# EasyEDA Pro project RGB_Connect_CG_EASYEDA_PROJECT.epro

# Schematic Schematic1
Board Name: Board1; Create Date: 2025-12-11; Page Name: P1; Project Name: RGB Connect; Schematic Name: Schematic1; Update Date: 2025-12-15; Company: EasyEDA.com; Page Size: A4; Version: V1.0
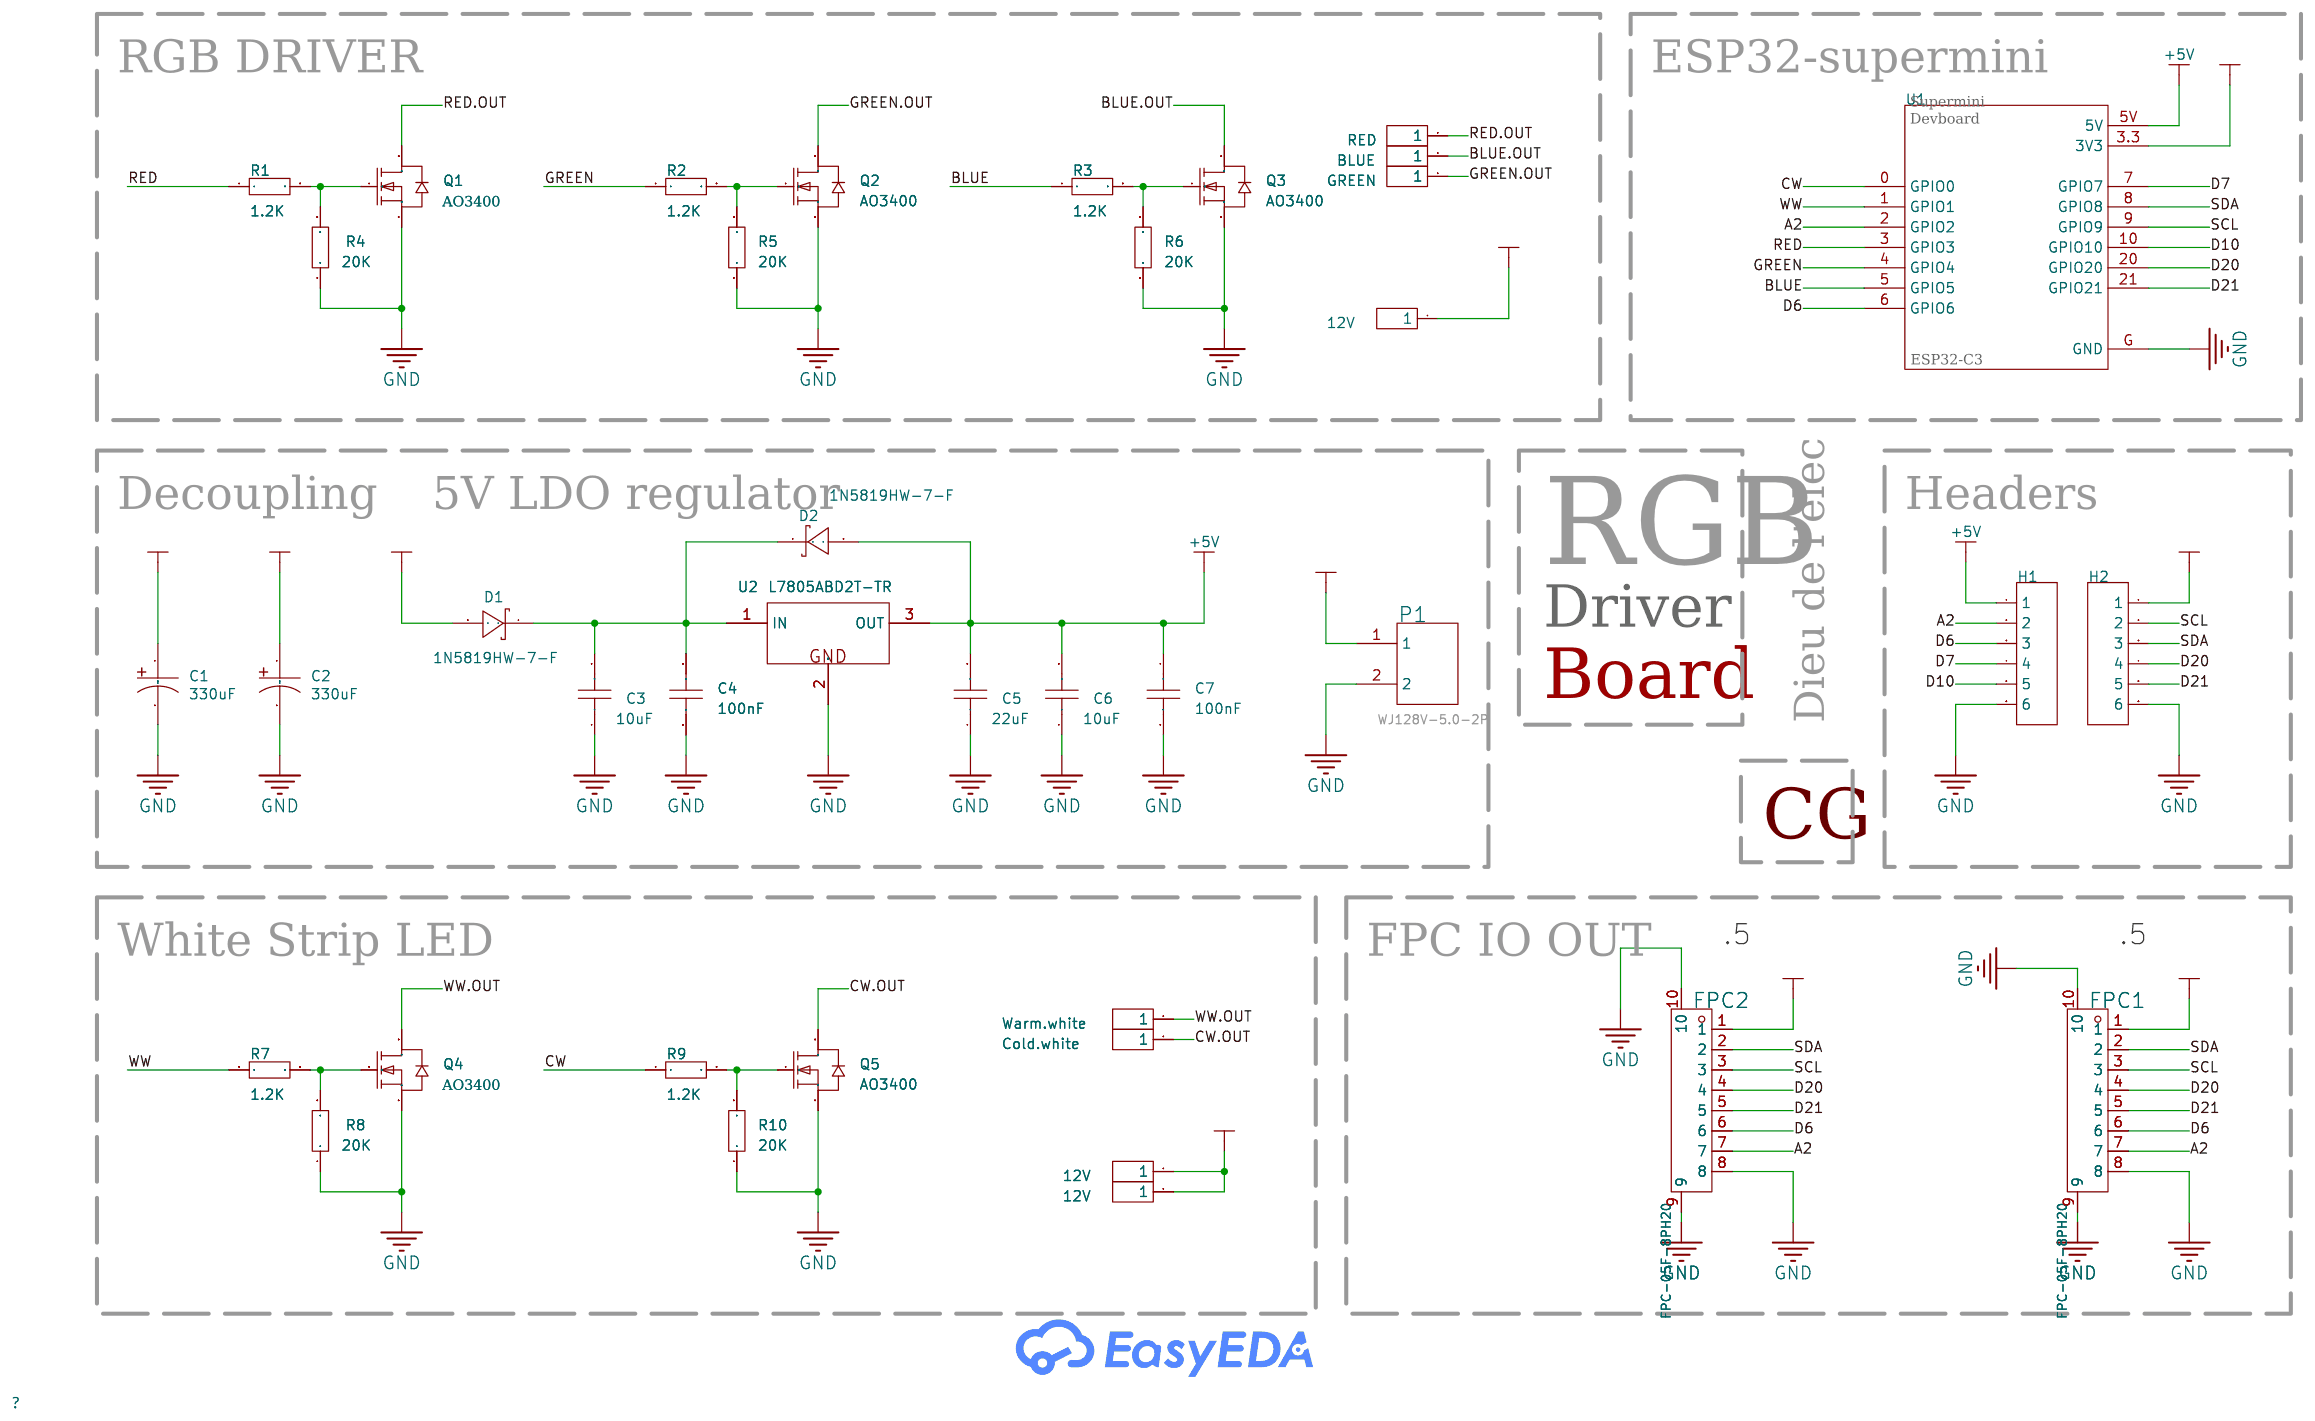
[diagram p0: schematic sheet]

## Parts
12V  2.54-1*1P针  [clear 1p header]
12V#2  2.54-1*1P针  [clear 1p header]
12V#3  2.54-1*1P针  [clear 1p header]
BLUE  2.54-1*1P针  [clear 1p header]
C1  330uF  [CAP-SMD_BD10.0-L10.3-W10.3-LS11.0-FD]
C2  330uF  [CAP-SMD_BD10.0-L10.3-W10.3-LS11.0-FD]
C3  10uF  [C0805]
C4  100nF  [0603 CAP clean]
C5  22uF  [C0805]
C6  10uF  [C0805]
C7  100nF  [0603 CAP clean]
Cold.white  2.54-1*1P针  [clear 1p header]
D1  1N5819HW-7-F  [SOD-123_L2.7-W1.6-LS3.7-RD]
D2  1N5819HW-7-F  [SOD-123_L2.7-W1.6-LS3.7-RD]
FPC1  FPC-05F-8PH20  [FPC-SMD_8P-P0.50_FPC-05F-8PH20]
FPC2  FPC-05F-8PH20  [FPC-SMD_8P-P0.50_FPC-05F-8PH20]
GREEN  2.54-1*1P针  [clear 1p header]
H1  -  [HDR-TH_6P-P2.54-V-M-1]
H2  -  [HDR-TH_6P-P2.54-V-M-1]
P1  WJ128V-5.0-2P  [SCREW TERMINAL PAD WITHOUT SILKSCREEN]
Q1  AO3400  [SOT-23-3_L3.0-W1.6-P1.90-LS2.8-BR]
Q2  AO3400  [SOT-23-3_L3.0-W1.6-P1.90-LS2.8-BR]
Q3  AO3400  [SOT-23-3_L3.0-W1.6-P1.90-LS2.8-BR]
Q4  AO3400  [SOT-23-3_L3.0-W1.6-P1.90-LS2.8-BR]
Q5  AO3400  [SOT-23-3_L3.0-W1.6-P1.90-LS2.8-BR]
R1  1.2K  [R0603]
R2  1.2K  [R0603]
R3  1.2K  [R0603]
R4  20K  [R0603]
R5  20K  [R0603]
R6  20K  [R0603]
R7  1.2K  [R0603]
R8  20K  [R0603]
R9  1.2K  [R0603]
R10  20K  [R0603]
RED  2.54-1*1P针  [clear 1p header]
U1  ESP32-C3_SUPERMINI  [ESP32 supermini board]
U2  L7805ABD2T-TR  [TO-263-2_L10.0-W9.2-P5.08-LS15.3-TL-CW]
Warm.white  2.54-1*1P针  [clear 1p header]

## Library data of the parts
12V 12V#2 12V#3 BLUE Cold.white GREEN RED Warm.white = 2.54-1*1P针: Pin Structure:- Pitch:- Row Spacing:- Circluar Pins/Square Pins:- Mounting Type:Straight Number of Rows:Single Row Number of Pins:1P Current Rating:- Voltage Rating (Max):- Length of Mating Pin:- Insulation Height:- Contact Material:- Contact Plating:- Co; LCSC Part Name: 直插; Supplier Part: C81276; Manufacturer: BOOMELE(博穆精密); Supplier Footprint: 插件,P=2.54mm; JLCPCB Part Class: Extended Part; Datasheet: https://atta.szlcsc.com/upload/public/pdf/source/20221018/3E9408392E35E6F57A28985E5F7BF5C9.pdf; Supplier: LCSC; Mounting Type: Straight; Number of Rows: Single Row; Number of Pins: 1P; Color: Black
C1 C2 = 35TZV330M10X10.5: Capacitance:330uF Tolerance:±20% Tolerance:±20% Voltage Rating:35V Ripple Current:510mA@120Hz Equivalent Series Resistance(ESR):- Diameter:10mm Height - Seated (Max):10.5mm Lifetime:2000hrs@105℃ Operating Temperature:-55℃~+105℃ Operating Temperature:-55℃~; LCSC Part Name: 330uF ±20% 35V; Supplier Part: C88796; Manufacturer: Rubycon(红宝石); Supplier Footprint: SMD,D10xL10.5mm; JLCPCB Part Class: Extended Part; Datasheet: https://item.szlcsc.com/datasheet/35TZV330M10X10.5/89976.html; Supplier: LCSC; Tolerance: ±20%; Voltage Rating: 35V; Ripple Current: 510mA@120Hz; Diameter: 10mm; Height - Seated (Max): 10.5mm; Lifetime: 2000hrs@105℃; Operating Temperature: -55℃~+105℃
C3 C5 C6 = CL21A106KAYNNNE_C15850: Capacitance: Tolerance:±10% Tolerance:±10% Voltage Rated: Temperature Coefficient:; LCSC Part Name: 10uF ±10% 25V; Supplier Part: C15850; Manufacturer: SAMSUNG(三星); Manufacturer Part: CL21A106KAYNNNE; Supplier Footprint: 0805; JLCPCB Part Class: Basic Part; Datasheet: https://atta.szlcsc.com/upload/public/pdf/source/20160218/1457707763339.pdf; Supplier: LCSC; Tolerance: ±10%
C4 C7 = CL10B104KO8NNNC: Capacitance:100nF Tolerance:±10% Tolerance:±10% Voltage Rating:16V Temperature Coefficient:X7R; LCSC Part Name: 100nF ±10% 16V; Supplier Part: C66501; Manufacturer: SAMSUNG(三星); Supplier Footprint: 0603; JLCPCB Part Class: Extended Part; Datasheet: https://item.szlcsc.com/datasheet/CL10B104KO8NNNC/67585.html; Supplier: LCSC; Tolerance: ±10%; Voltage Rating: 16V; Temperature Coefficient: X7R
D1 D2 = 1N5819HW-7-F: Diode Configuration:1 Independent Voltage - Forward(Vf@If):450mV@1A Voltage - DC Reverse(Vr):40V Current - Rectified:1A Reverse Leakage Current (Ir):1mA@40V Operating Junction Temperature Range:-65℃~+150℃ Operating Junction Temperature Range:-65℃~+150℃ No; LCSC Part Name: 电压:40V 电流:1A; Supplier Part: C82544; Manufacturer: DIODES(美台); Supplier Footprint: SOD-123; JLCPCB Part Class: Extended Part; Datasheet: https://item.szlcsc.com/datasheet/1N5819HW-7-F/83701.html; Supplier: LCSC; Diode Configuration: 1 Independent; Voltage - Forward(Vf@If): 450mV@1A; Voltage - DC Reverse(Vr): 40V; Current - Rectified: 1A; Reverse Leakage Current (Ir): 1mA@40V; Operating Junction Temperature Range: -65℃~+150℃; Non-Repetitive Peak Forward Surge Current: 25A
FPC1 FPC2 = FPC-05F-8PH20: Locking Feature:Hinged Lid Contact Type:Surface Mount Number of Contacts:8P Pitch:0.5mm Mounting Type:Bottom Contact FFC, FCB Thickness:0.3mm FFC, FCB Thickness:0.3mm Height Above Board:2mm Contact Material:Phosphor Bronze Contact Plating:Tin Operating Te; LCSC Part Name: 翻盖式 卧贴 P数:8P 间距:0.5mm; Supplier Part: C2856797; Manufacturer: XUNPU(讯普); Supplier Footprint: SMD,P=0.5mm,卧贴; JLCPCB Part Class: Extended Part; Datasheet: https://item.szlcsc.com/datasheet/FPC-05F-8PH20/3056895.html; Supplier: LCSC; Locking Feature: Hinged Lid; Contact Type: Surface Mount; Number of Contacts: 8P; Pitch: 0.5mm; Mounting Type: Bottom Contact; FFC, FCB Thickness: 0.3mm; Height Above Board: 2mm; Contact Material: Phosphor Bronze; Contact Plating: Tin; Operating Temperature: -25℃~+85℃; Rated Voltage (Max): 50V; Current Rating (Max): 500mA
H1 H2 = HDR-M_2.54_1x6P: Supplier Footprint: Through
P1 = WJ128V-5.0-2P: Structure:1x2P Pitch:5mm Color:Green Mounting Style:Straight Current Rating (Max):20A Voltage Rating (Max):250V Number of Pins:2P Number of Rows:1 Wire Gauge - AWG:12~22 Wire Gauge - AWG:12~22 Wire Gauge - mm2:2.5 Wire Gauge - mm2:2.5 Number of PINs Per R; LCSC Part Name: 5mm 1x2P 排数:1 每排P数:2 直插; Supplier Part: C8269; Manufacturer: KANGNEX(康奈克斯电气); Supplier Footprint: 插件,P=5mm; JLCPCB Part Class: Extended Part; Datasheet: https://atta.szlcsc.com/upload/public/pdf/source/20191225/C8269_1FF44D6D2E83DB14A7CA266A410FD9AD.pdf; Supplier: LCSC; Structure: 1x2P; Pitch: 5mm; Color: Green; Mounting Style: Straight; Current Rating (Max): 20A; Voltage Rating (Max): 250V; Number of Pins: 2P; Number of Rows: 1; Wire Gauge - AWG: 12~22; Wire Gauge - mm2: 2.5; Number of PINs Per Row: 2; Operating Temperature Range: -40℃~+105℃
Q1-Q5 = KO3400: Type:1 N-channel Drain to Source Voltage:30V Current - Continuous Drain(Id):5.8A RDS(on):28mΩ@10V,5.8A Pd - Power Dissipation:1.4W Gate Threshold Voltage (Vgs(th)@Id):1.4V Gate Charge(Qg):- Input Capacitance(Ciss@Vds):1.05nF Reverse Transfer Capacitance (; LCSC Part Name: 1个N沟道 耐压:30V 电流:5.8A; Supplier Part: C369934; Manufacturer: KEXIN(科信); Supplier Footprint: SOT-23; JLCPCB Part Class: Extended Part; Datasheet: https://atta.szlcsc.com/upload/public/pdf/source/20190705/C382311_CA39E9155B06A0BE2095D07146EBD822.pdf; Supplier: LCSC; Type: 1 N-channel; Drain to Source Voltage: 30V; Current - Continuous Drain(Id): 5.8A; RDS(on): 28mΩ@10V,5.8A; Pd - Power Dissipation: 1.4W; Gate Threshold Voltage (Vgs(th)@Id): 1.4V; Input Capacitance(Ciss@Vds): 1.05nF; Reverse Transfer Capacitance (Crss@Vds): 77pF@15V; Operating Temperature: -55℃~+150℃
R1-R10 = Res_0603: Supplier Footprint: 0603
U1 = ESP32-C3_SUPERMINI_ESP32-C3_SUPERMINI: MF: Espressif Systems; MAXIMUM_PACKAGE_HEIGHT: 4.2mm; Price: None; Check_prices: https://www.snapeda.com/parts/ESP32-C3%20SuperMini_TH/Espressif+Systems/view-part/?ref=eda; STANDARD: Manufacturer Recommendations; SnapEDA_Link: https://www.snapeda.com/parts/ESP32-C3%20SuperMini_TH/Espressif+Systems/view-part/?ref=snap; MP: ESP32-C3 SuperMini_TH; Description_1: \n                        \n                            Super tiny ESP32-C3 board\n                        \n; Availability: Not in stock; MANUFACTURER: Espressif
U2 = L7805ABD2T-TR: Output Type:Fixed Voltage - Supply:35V Output Voltage:5V Output Voltage:5V Output Current:1.5A Power Supply Rejection Ratio (PSRR):68dB@(120Hz) Voltage Dropout:2V@(1A) standby current:4.3mA Noise:- Features:Short Circuit Protection；Over Temperature Protec; LCSC Part Name: 正稳压器IC; Supplier Part: C86206; Manufacturer: ST(意法半导体); Supplier Footprint: TO-263-2; JLCPCB Part Class: Extended Part; Datasheet: https://item.szlcsc.com/datasheet/L7805ABD2T-TR/87382.html; Supplier: LCSC; Output Type: Fixed; Voltage - Supply: 35V; Output Voltage: 5V; Output Current: 1.5A; Power Supply Rejection Ratio (PSRR): 68dB@(120Hz); Voltage Dropout: 2V@(1A); standby current: 4.3mA; Features: Short Circuit Protection；Over Temperature Protection; Operating Temperature: -40℃~+125℃@(Tj); Output Configuration: Positive; Number of Outputs: 1

## Nets
12V.IN: 12V.1 12V#2.1 12V#3.1 C1.1 C2.1 D1.2(A) P1.1
+3.3V: FPC1.1 FPC2.1 H2.1 U1.3.3(3V3)
+5V: C5.2 C6.2 C7.1 D2.2(A) H1.1 U1.5V U2.3(OUT)
GND: C1.2 C2.2 C3.1 C4.2 C5.1 C6.1 C7.2 FPC1.8 FPC1.9 FPC1.10 FPC2.8 FPC2.9 FPC2.10 H1.6 H2.6 P1.2 Q1.2(S) Q2.2(S) Q3.2(S) Q4.2(S) Q5.2(S) R4.1 R5.1 R6.1 R8.1 R10.1 U1.G(GND) U2.2(GND)
A2: FPC1.7 FPC2.7 H1.2 U1.2(GPIO2)
BLUE: R3.1 U1.5(GPIO5)
BLUE.OUT: BLUE.1 Q3.3(D)
CW: R9.1 U1.0(GPIO0)
CW.OUT: Cold.white.1 Q5.3(D)
D6: FPC1.6 FPC2.6 H1.3 U1.6(GPIO6)
D7: H1.4 U1.7(GPIO7)
D10: H1.5 U1.10(GPIO10)
D20: FPC1.4 FPC2.4 H2.4 U1.20(GPIO20)
D21: FPC1.5 FPC2.5 H2.5 U1.21(GPIO21)
GREEN: R2.1 U1.4(GPIO4)
GREEN.OUT: GREEN.1 Q2.3(D)
RED: R1.1 U1.3(GPIO3)
RED.OUT: Q1.3(D) RED.1
SCL: FPC1.3 FPC2.3 H2.2 U1.9(GPIO9)
SDA: FPC1.2 FPC2.2 H2.3 U1.8(GPIO8)
WW: R7.1 U1.1(GPIO1)
WW.OUT: Q4.3(D) Warm.white.1
$1N809: Q1.1(G) R1.2 R4.2
$1N813: Q2.1(G) R2.2 R5.2
$1N817: Q3.1(G) R3.2 R6.2
$1N1755: C3.2 C4.1 D1.1(K) D2.1(K) U2.1(IN)
$1N4670: Q4.1(G) R7.2 R8.2
$1N4674: Q5.1(G) R9.2 R10.2

## Notes on the sheet
- RGB DRIVER
- ESP32-supermini
- Supermini
  Devboard
- Decoupling
- 5V LDO regulator
- Headers
- RGB
- Driver
- Board
- Dieu de l'elec
- CG
- .5
- .5
- White Strip LED
- FPC IO OUT

# Board PCB1
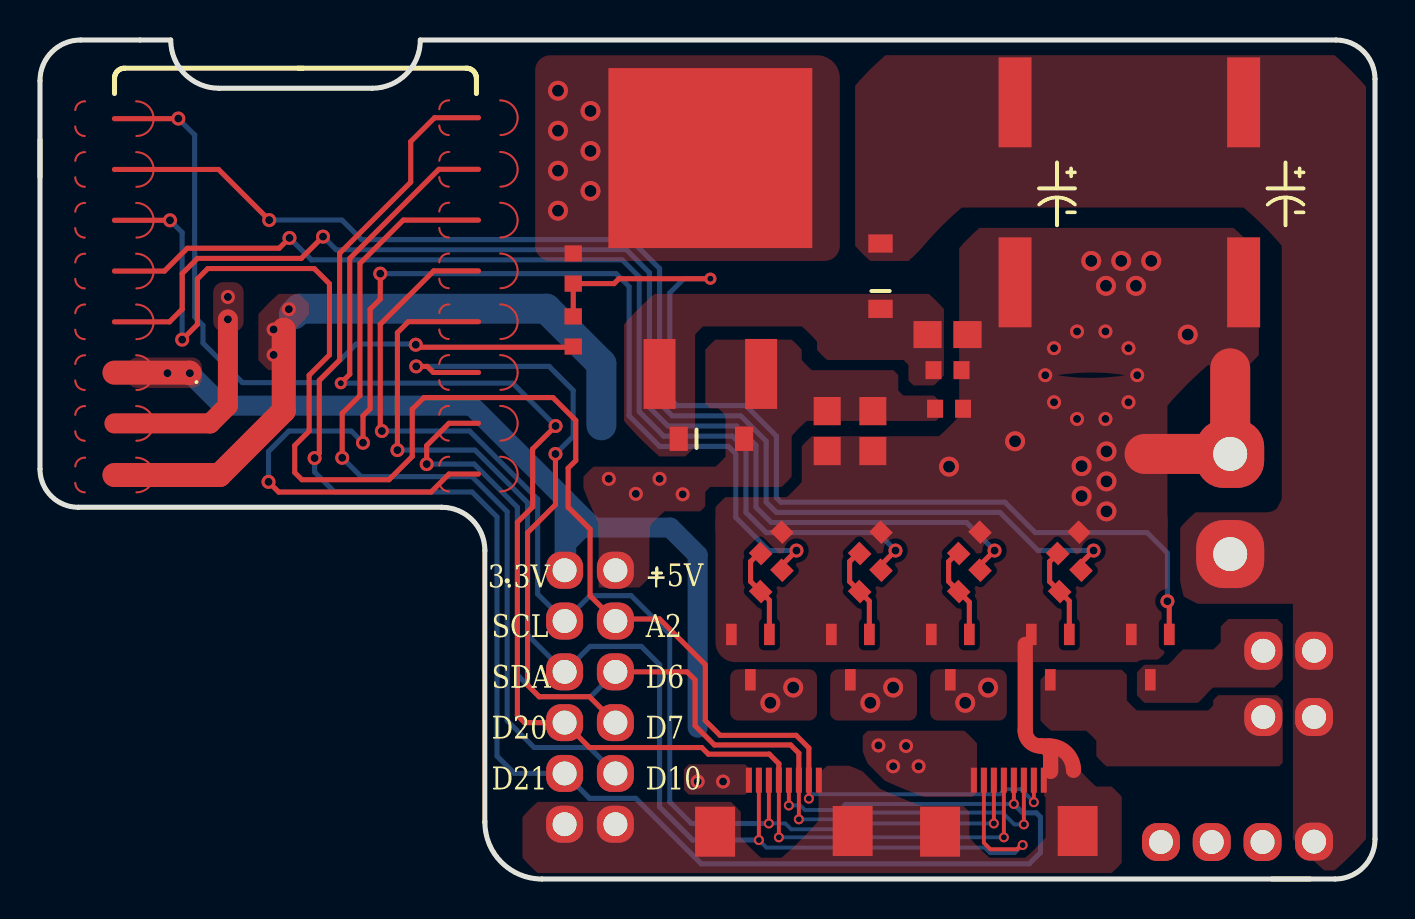
[diagram p1: board, top side]
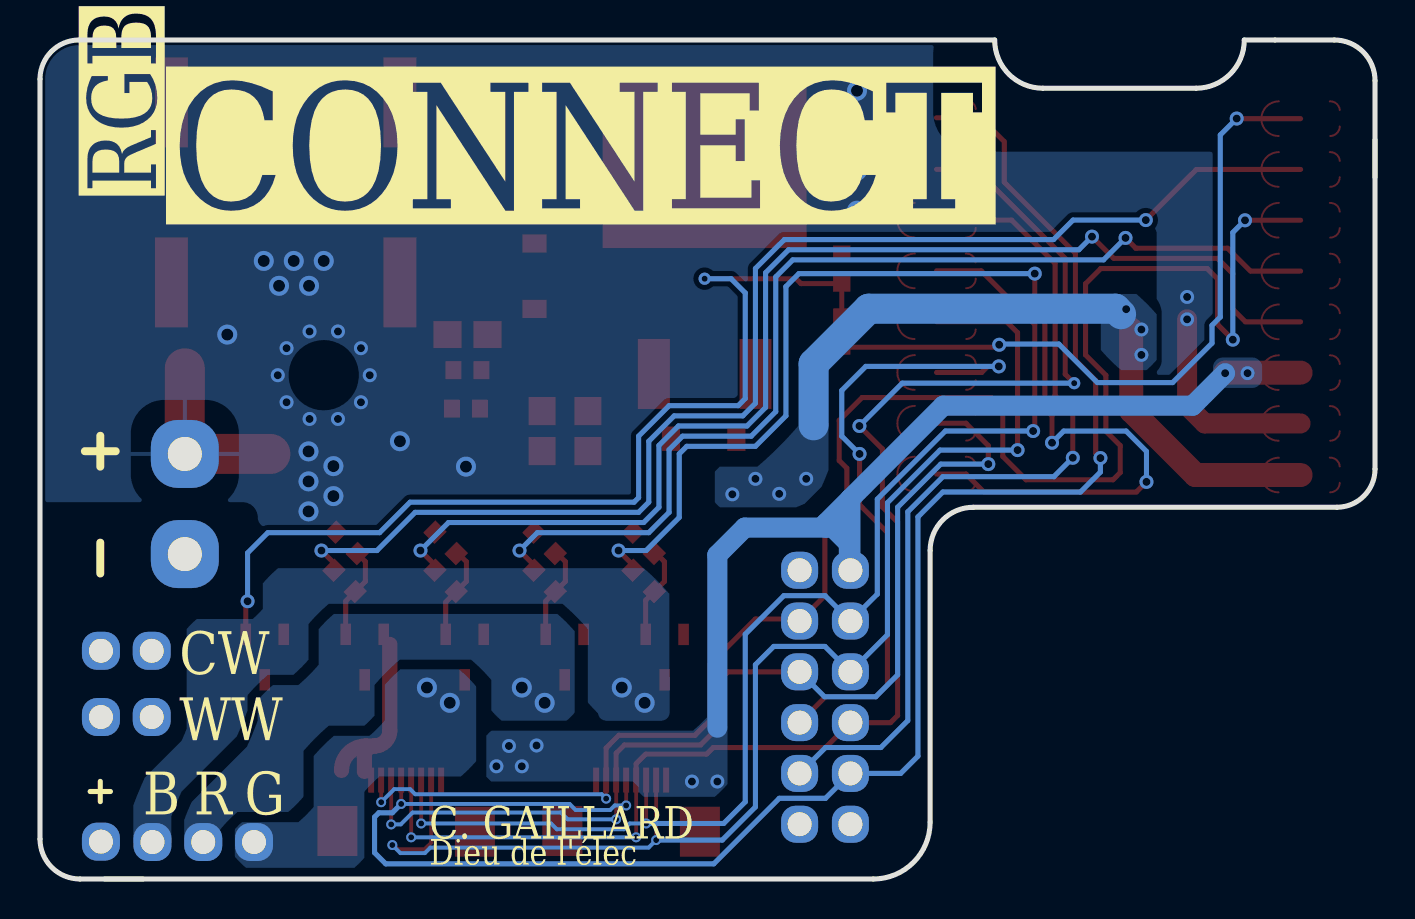
[diagram p2: board, bottom side, seen from below]

Outline 66.77 x 41.96 mm; copper layers: Top Layer, Bottom Layer. Coordinates in mm from the lower left corner of the outline.
Outline path: 0,35.1 0,39.93 arc(0.6,41.36) 2.03,41.96 6.54,41.96 arc(7.24,40.25) 8.95,39.55 16.61,39.55 arc(18.32,40.25) 19.02,41.96 64.81,41.96 arc(66.2,41.38) 66.77,40 66.77,2 arc(66.18,0.59) 64.77,0 61.63,0 ; 0,36.96 0,20.5 arc(0.56,19.15) 1.91,18.59 20.09,18.59 arc(21.62,17.96) 22.25,16.43 22.25,2.84 arc(23.08,0.83) 25.09,0 63.53,0
Stack: Top Layer 0.035mm / Dielectric1 1.51mm FR4 er 4.5 / Bottom Layer 0.035mm

## Design rules (mm)
template: Custom Config
spacing copperThickness1oz (default): track to track 0.102, other pairs 0.152 to 0.3
spacing copperThickness2oz: track to track 0.203, other pairs 0.152 to 0.3
track width copperThickness1oz (default): min 0.127, default 0.254, max 2.54
track width copperThickness2oz: min 0.203, default 0.254, max 2.54
differential pair differentialPair (default): width min 0.127, default 0.254, max 2.54; gap min 0.152, default 0.152
via viaSize (default): diameter min 0.5, default 0.61, max 10; hole min 0.3, default 0.305, max 6.3

## Placement (name value [footprint] x y rotation side)
12V  2.54-1*1P针  [clear 1p header]  63.72 8.1 180 top
12V#2  2.54-1*1P针  [clear 1p header]  63.72 1.87 180 top
12V#3  2.54-1*1P针  [clear 1p header]  63.72 11.41 180 top
BLUE  2.54-1*1P针  [clear 1p header]  61.14 1.85 270 top
C1  330uF  [CAP-SMD_BD10.0-L10.3-W10.3-LS11.0-FD]  60.2 34.34 270 top
C2  330uF  [CAP-SMD_BD10.0-L10.3-W10.3-LS11.0-FD]  48.77 34.34 270 top
C3  10uF  [C0805]  45.39 27.23 180 top
C4  100nF  [0603 CAP clean]  45.39 25.45 0 top
C5  22uF  [C0805]  41.66 22.4 90 top
C6  10uF  [C0805]  39.37 22.4 90 top
C7  100nF  [0603 CAP clean]  45.47 23.52 0 top
Cold.white  2.54-1*1P针  [clear 1p header]  61.18 11.41 180 top
D1  1N5819HW-7-F  [SOD-123_L2.7-W1.6-LS3.7-RD]  42.04 30.15 90 top
D2  1N5819HW-7-F  [SOD-123_L2.7-W1.6-LS3.7-RD]  33.58 22.02 0 top
FPC1  FPC-05F-8PH20  [FPC-SMD_8P-P0.50_FPC-05F-8PH20]  48.46 3.66 0 top
FPC2  FPC-05F-8PH20  [FPC-SMD_8P-P0.50_FPC-05F-8PH20]  37.2 3.66 0 top
GREEN  2.54-1*1P针  [clear 1p header]  56.07 1.85 270 top
H1  -  [HDR-TH_6P-P2.54-V-M-1]  28.78 9.09 270 top
H2  -  [HDR-TH_6P-P2.54-V-M-1]  26.24 9.09 270 top
P1  WJ128V-5.0-2P  [SCREW TERMINAL PAD WITHOUT SILKSCREEN]  60.16 18.5 90 top
Q1  AO3400  [SOT-23-3_L3.0-W1.6-P1.90-LS2.8-BR]  40.53 11.1 90 top
Q2  AO3400  [SOT-23-3_L3.0-W1.6-P1.90-LS2.8-BR]  45.53 11.1 90 top
Q3  AO3400  [SOT-23-3_L3.0-W1.6-P1.90-LS2.8-BR]  35.53 11.1 90 top
Q4  AO3400  [SOT-23-3_L3.0-W1.6-P1.90-LS2.8-BR]  50.53 11.1 90 top
Q5  AO3400  [SOT-23-3_L3.0-W1.6-P1.90-LS2.8-BR]  55.53 11.1 90 top
R1  1.2K  [R0603]  41.53 14.91 225 top
R2  1.2K  [R0603]  46.48 14.91 225 top
R3  1.2K  [R0603]  36.58 14.91 225 top
R4  20K  [R0603]  41.53 16.81 225 top
R5  20K  [R0603]  46.48 16.81 225 top
R6  20K  [R0603]  36.58 16.81 225 top
R7  1.2K  [R0603]  51.53 14.91 225 top
R8  20K  [R0603]  51.43 16.81 225 top
R9  1.2K  [R0603]  26.67 27.38 90 top
R10  20K  [R0603]  26.67 30.53 270 top
RED  2.54-1*1P针  [clear 1p header]  58.61 1.85 270 top
U1  ESP32-C3_SUPERMINI  [ESP32 supermini board]  12.83 30.15 180 top
U2  L7805ABD2T-TR  [TO-263-2_L10.0-W9.2-P5.08-LS15.3-TL-CW]  33.53 30.66 90 top
Warm.white  2.54-1*1P针  [clear 1p header]  61.18 8.1 180 top

## Footprints (pads in the part's own frame, mm; a bottom-side part is the same pattern mirrored in y, then rotated)
0603 CAP clean
  rect 0.8x0.9 smd: 1(-0.7,0) 2(0.7,0)
C0805
  rect 1.41x1.35 smd: 1(-1,0) 2(1,0)
CAP-SMD_BD10.0-L10.3-W10.3-LS11.0-FD
  rect 4.5x1.65 smd: 1(-4.5,0) 2(4.5,0)
clear 1p header
  rrect 1.9x1.9 hole 1.2: 1(0,0)
ESP32 supermini board
  custom 3.919x1.734 smd: 0(9.104,-7.876) 1(9.104,-5.336) 2(9.104,-2.796) 3(9.104,-0.256) 3V3(9.104,4.824) 4(9.104,2.284) 5(-9.104,9.896) 5V(9.104,9.944) 6(-9.104,7.356) 7(-9.104,4.816) 8(-9.104,2.276) 9(-9.104,-0.264) 10(-9.104,-2.804) 20(-9.104,-5.344) 21(-9.104,-7.924) G(9.104,7.364)
FPC-SMD_8P-P0.50_FPC-05F-8PH20
  rect 0.3x1.25 smd: 1(-1.75,1.288) 2(-1.25,1.288) 3(-0.75,1.288) 4(-0.25,1.288) 5(0.25,1.288) 6(0.75,1.288) 7(1.25,1.288) 8(1.75,1.288)
  rect 2x2.5 smd: 9(3.44,-1.252) 10(-3.44,-1.288)
HDR-TH_6P-P2.54-V-M-1
  rrect 1.85x1.85 hole 1.2: 1(-6.35,0) 2(-3.81,0) 3(-1.27,0) 4(1.27,0) 5(3.81,0) 6(6.35,0)
R0603
  rect 0.806x0.864 smd: 1(-0.753,0) 2(0.753,0)
SCREW TERMINAL PAD WITHOUT SILKSCREEN
  rrect 3.4x3.4 hole 1.7: 1(-2.251,0.635) 2(2.758,0.635)
SOD-123_L2.7-W1.6-LS3.7-RD
  rect 0.91x1.22 smd: 1(-1.635,0) 2(1.635,0)
SOT-23-3_L3.0-W1.6-P1.90-LS2.8-BR
  rect 1.07x0.532 smd: 1(1.135,-0.95) 2(1.135,0.95) 3(-1.135,0)
TO-263-2_L10.0-W9.2-P5.08-LS15.3-TL-CW
  rect 3.5x1.6 smd: 1(-5.397,2.54) 3(-5.397,-2.54)
  rect 9x10.2 smd: 2(5.397,0)

## Nets
As in the schematic, except:
+3.3V: FPC1.1 FPC2.1 H2.1 U1.3V3

## Via types
v1: diameter 0.7, hole 0.4, Top Layer to Bottom Layer, 50 vias
v2: diameter 1, hole 0.6, Top Layer to Bottom Layer, 26 vias
v3: diameter 0.5, hole 0.3, Top Layer to Bottom Layer, 12 vias
v4: diameter 0.61, hole 0.305, Top Layer to Bottom Layer, 2 vias

## Routing (per net, layer and track width the routed paths; a pad name or vN(x,y) marks a point on that pad's centre or on a via; arc(x,y) is an arc through that point)
+3.3V: length 48.1
  Top Layer w1.2: v1(7.5,25.3) 7.47,25.32 U1.3V3
  Bottom Layer w1: 26.24,19.02 27.47,17.79 27.47,17.57 ; 26.24,19.02 21.59,23.67 9.12,23.67 v1(7.5,25.3) ; 26.24,19.02 H2.1 26.31,15.52 26.31,16.77 27.11,17.57 27.47,17.57 ; 32.89,7.57 32.89,16.2 31.52,17.57 27.47,17.57
  vias: v1(6.38,25.3) v1(32.89,4.87) v1(34.16,4.87) v1(41.94,6.68) v1(42.67,5.64) v1(43.32,6.65) v1(43.94,5.64)
+5V: length 33.6
  Top Layer w1.2: 3.72,20.2 8.98,20.2 12.19,23.42 12.19,27.48
  Bottom Layer w1.5: 28.08,22.69 28.08,25.77 25.33,28.52 12.98,28.52 12.7,28.24
  vias: v1(11.68,27.48) v1(11.68,26.21) v1(12.45,28.5) v1(28.45,20.01) v1(29.8,19.26) v1(30.99,20.01) v1(32.14,19.24)
GND: length 28.3
  Top Layer w0.762: 50.55,5.38 50.55,6.14 arc(50.4,6.5) 50.04,6.65 ; 49.28,11.73 49.28,7.41 arc(49.5,6.88) 50.04,6.65 ; 50.04,6.65 50.47,6.65 arc(51.33,6.29) 51.69,5.43
  Top Layer w1: 3.72,22.78 8.51,22.78 9.4,23.67 v1(9.4,27.99)
  Top Layer w2: 59.53,25.54 P1.2 55.24,21.26
  vias: v1(9.4,29.11) v1(50.28,25.19) v1(50.72,26.55) v1(50.72,23.84) v1(51.87,27.38) v1(51.87,23.01) v1(53.29,27.38) v1(53.29,23.01) v1(54.44,26.55) v1(54.44,23.84) v1(54.88,25.19) v2(25.91,39.42) v2(25.91,37.42) v2(25.91,35.42) v2(25.91,33.42) v2(27.53,38.41) v2(27.53,36.41) v2(27.53,34.41) v2(45.47,20.62) v2(48.77,21.89) v2(52.1,20.65) v2(52.1,19.15) v2(52.58,30.91) v2(53.31,29.66) v2(53.34,21.38) v2(53.34,19.88) v2(53.34,18.38) v2(54.08,30.91) v2(54.81,29.66) v2(55.58,30.91) v2(57.4,27.23)
A2: length 88
  Top Layer w0.193: v3(38.45,4.02) FPC2.7 ; v3(49.71,3.84) FPC1.7
  Top Layer w0.254: v1(6.5,32.94) 6.5,32.94 U1.2 ; FPC2.7 38.45,6.55 37.82,7.19 34.01,7.19 33.27,7.92 33.27,10.72 30.99,13 28.88,13 H1.2 27.51,14.16 27.51,17.49 26.42,18.59 26.42,20.55 26.8,20.93 26.8,22.93 25.65,24.08 19.2,24.08 18.62,23.49 18.62,21.13 17.45,19.97 13.1,19.97 12.74,20.33 12.74,21.68 13.46,22.4 13.46,25.19 14.48,26.21 14.48,29.77 13.72,30.53 8.39,30.53 7.87,30.01 7.87,27.73 v1(7.11,26.97)
  Bottom Layer w0.193: v3(49.71,3.84) 49.05,4.49 48.26,4.49 48.01,4.24 38.67,4.24 v3(38.45,4.02)
  Bottom Layer w0.254: v1(6.5,32.94) 7.11,32.33 v1(7.11,26.97)
BLUE: length 60.3
  Top Layer w0.254: v1(11.43,19.86) 11.94,19.35 19.56,19.35 20.46,20.25 21.93,20.25 ; v1(37.83,16.43) 37.11,15.7 R3.1 ; v1(16.15,21.82) 16.15,23.16 16.51,23.52 16.51,28.5 17.02,29 v1(17.02,30.27)
  Bottom Layer w0.254: v1(11.43,19.86) 11.43,21.38 12.45,22.4 15.57,22.4 v1(16.15,21.82) ; v1(17.02,30.27) 28.81,30.27 29.46,29.62 29.46,23.16 30.99,21.64 34.42,21.64 34.8,21.26 34.8,18.08 36.45,16.43 v1(37.83,16.43)
BLUE.OUT:
  vias: v2(36.53,8.81) v2(37.67,9.57)
CW: length 35.2
  Top Layer w0.254: U1.0 6.91,38.02 v1(6.92,38.03) ; 18.8,26.79 18.99,26.59 26.67,26.59
  Bottom Layer w0.254: 18.88,26.75 15.81,26.75 13.89,24.83 10.12,24.83 8.15,26.8 8.15,27.69 7.74,28.1 7.74,37.21 v1(6.92,38.03)
  vias: v1(18.8,26.72)
D6: length 53
  Top Layer w0.193: v3(49.21,2.73) FPC1.6 ; v3(37.95,2.98) FPC2.6
  Top Layer w0.254: v1(19.34,20.75) 19.34,21.67 20.46,22.79 U1.6 ; H1.3 32.36,10.36 32.77,9.95 32.77,7.67 33.73,6.7 37.54,6.7 37.95,6.29 FPC2.6
  Bottom Layer w0.193: v3(49.21,2.73) 48.73,2.73 48.13,3.32 40.72,3.32 40.38,2.98 v3(37.95,2.98)
  Bottom Layer w0.254: H1.3 27.53,9.12 24.97,9.12 23.88,10.21 23.88,18.59 21.72,20.75 v1(19.34,20.75)
D7: length 32.4
  Top Layer w0.254: v1(25.78,21.26) 25.78,18.72 24.38,17.32 24.38,9.7 24.97,9.12 27.48,9.12 H1.4 ; 21.93,25.33 19.67,25.33 19.37,25.64 v1(18.82,25.64)
  Bottom Layer w0.254: v1(18.82,25.64) 25.47,25.64 26.67,24.43 26.67,22.15 v1(25.78,21.26)
D10: length 43.2
  Top Layer w0.254: U1.10 18.17,32.95 16,30.78 16,24.18 15.11,23.29 v1(15.11,21.06)
  Bottom Layer w0.254: v1(15.11,21.06) 16.06,20.12 21.61,20.12 23.37,18.36 23.37,7.92 24.71,6.58 27.48,6.58 H1.5
D20: length 73.5
  Top Layer w0.193: v3(36.95,2.08) FPC2.4 ; v3(48.21,2.08) FPC1.4
  Top Layer w0.254: FPC2.4 36.95,5.77 36.47,6.25 33.43,6.25 33.1,6.58 27.48,6.58 H2.4 24.23,7.82 23.88,8.18 23.88,17.84 24.64,18.6 24.64,21.5 v1(25.79,22.65) ; v4(15.05,24.8) 15.49,25.24 15.49,31.04 19.95,35.49 21.93,35.49
  Bottom Layer w0.193: v3(36.95,2.08) v3(48.21,2.08)
  Bottom Layer w0.254: v1(25.79,22.65) 23.64,24.8 v4(15.05,24.8)
D21: length 91.4
  Top Layer w0.193: v3(37.45,3.68) FPC2.5 ; v3(48.71,3.75) FPC1.5
  Top Layer w0.254: v1(13.73,21.05) 13.97,21.29 13.97,24.94 14.99,25.96 14.99,31.29 18.54,34.85 18.54,36.88 19.73,38.07 U1.21
  Bottom Layer w0.193: v3(37.45,3.68) 38.03,3.68 38.25,3.45 39.98,3.45 40.28,3.75 v3(48.71,3.75)
  Bottom Layer w0.254: v1(13.73,21.05) 13.73,20.35 14.73,19.35 21.62,19.35 22.86,18.11 22.86,6.14 23.72,5.28 H2.5 27.48,4.04 29.79,4.04 33.07,0.76 49.48,0.76 50.04,1.32 50.04,3.1 49.82,3.31 49.15,3.31 v3(48.71,3.75)
GREEN: length 60.4
  Top Layer w0.254: v1(47.74,16.43) 47.01,15.7 R2.1 ; 3.72,27.86 6.48,27.86 7.11,28.5 7.11,30.27 7.87,31.04 13.07,31.04 v1(14.16,32.12)
  Bottom Layer w0.254: v1(47.74,16.43) 46.34,17.83 36.58,17.83 35.81,18.59 35.81,21.68 34.84,22.65 31.41,22.65 30.48,23.58 30.48,30.32 29.33,31.47 14.81,31.47 v1(14.16,32.12)
GREEN.OUT:
  vias: v2(46.27,8.81) v2(47.42,9.57)
RED: length 53.3
  Top Layer w0.254: U1.3 6.23,30.4 7.37,31.54 11.96,31.54 v1(12.48,32.06) ; v1(42.79,16.43) 42.06,15.7 R1.1
  Bottom Layer w0.254: v1(12.48,32.06) 13.58,30.96 29.12,30.96 29.97,30.11 29.97,23.37 31.2,22.15 34.63,22.15 35.31,21.47 35.31,18.34 36.32,17.32 41.89,17.32 v1(42.79,16.43)
RED.OUT:
  vias: v2(41.53,8.81) v2(42.67,9.57)
SCL: length 63.4
  Top Layer w0.193: v3(47.71,2.78) FPC1.3 ; v3(36.45,2.78) FPC2.3
  Top Layer w0.254: v1(17.1,22.4) 17.02,22.48 17.02,27.73 19.7,30.41 21.93,30.41
  Bottom Layer w0.193: v3(47.71,2.78) 41.21,2.78 40.92,2.49 37.57,2.49 37.27,2.78 v3(36.45,2.78)
  Bottom Layer w0.254: v3(36.45,2.78) 32.58,2.78 31.5,3.86 31.5,12.24 29.57,14.17 27.51,14.17 H2.2 24.89,14.25 24.89,19 21.49,22.4 v1(17.1,22.4)
SDA: length 67.3
  Top Layer w0.193: FPC2.2 v3(35.95,1.95) ; v3(49.15,1.7) 49.07,1.7 48.86,1.49 47.53,1.49 47.21,1.81 FPC1.2
  Top Layer w0.254: v1(17.88,21.45) 17.88,27.32 18.42,27.87 U1.8
  Bottom Layer w0.193: v3(49.15,1.7) 48.74,1.29 47.52,1.29 47.24,1.57 36.33,1.57 v3(35.95,1.95)
  Bottom Layer w0.254: v3(35.95,1.95) 32.64,1.95 30.99,3.6 30.99,10.72 30.07,11.63 27.51,11.63 H2.3 24.38,12.21 24.38,18.82 21.75,21.45 v1(17.88,21.45)
WW: length 63.8
  Top Layer w0.254: v1(11.46,32.95) 8.93,35.48 3.72,35.48 ; R7.1 52.06,15.8 v1(52.69,16.43)
  Bottom Layer w0.254: v1(52.69,16.43) 49.92,16.43 48.01,18.34 36.83,18.34 36.32,18.84 36.32,21.89 35.05,23.16 31.62,23.16 30.99,23.79 30.99,30.53 29.54,31.98 16.08,31.98 15.1,32.95 v1(11.46,32.95)
$1N809: length 4.6
  Top Layer w0.254: 40.9,16.28 40.49,15.87 40.49,14.88 R1.2 41.48,13.89 Q1.1
$1N813: length 4.6
  Top Layer w0.254: Q2.1 46.48,13.84 R2.2 45.45,14.88 45.45,15.87 45.85,16.28
$1N817: length 4.6
  Top Layer w0.254: Q3.1 36.48,13.94 R3.2 35.54,14.88 35.54,15.87 35.95,16.28
$1N4670: length 4.6
  Top Layer w0.254: R8.2 50.49,15.87 50.49,14.88 R7.2 51.48,13.89 Q4.1
$1N4674: length 50.4
  Top Layer w0.254: 26.67,27.98 R10.2 28.71,29.77 28.96,30.02 v4(33.53,30.02) ; v1(56.39,13.89) 56.48,13.8 Q5.1
  Bottom Layer w0.254: v1(56.39,13.89) 56.39,16.3 55.37,17.32 49.78,17.32 48.26,18.84 37.06,18.84 36.83,19.07 36.83,22.15 35.31,23.67 31.85,23.67 31.5,24.03 31.5,29.31 32.21,30.02 v4(33.53,30.02)

## Copper pours and planes (outline as drawn; the poured copper is in the pictures)
12V.IN on Top Layer: 40.77,41.2 66.32,41.2 66.32,0.43 40.77,0.43
+3.3V on Top Layer: 32.21,5.74 35.51,5.74 35.51,4.21 32.21,4.21
+3.3V on Top Layer: 4.37,26.08 8.1,26.08 8.1,24.56 4.37,24.56
+3.3V on Top Layer: 41.15,7.41 46.86,7.41 46.86,4.11 41.15,4.11
+3.3V on Bottom Layer: 5.64,26.08 8.1,26.08 8.1,24.56 5.64,24.56
+3.3V on Bottom Layer: 32.39,8.38 44.45,8.38 44.45,4.11 32.39,4.11
+5V on Top Layer: 27.18,26.97 45.06,26.97 45.06,14.58 27.18,14.58
+5V on Top Layer: 10.92,29.26 13.46,29.26 13.46,25.45 10.92,25.45
+5V on Bottom Layer: 27.33,22.86 33.02,22.86 33.02,18.59 27.33,18.59
+5V on Bottom Layer: 10.92,29.26 13.72,29.26 13.72,25.45 10.92,25.45
GND on Top Layer: 8.66,29.84 10.19,29.84 10.19,27.38 8.66,27.38
GND on Top Layer: 33.78,17.97 33.8,18.15 33.85,18.34 33.95,18.52 34.07,18.68 34.23,18.81 34.41,18.9 34.61,18.96 34.78,18.97 55.4,18.97 55.57,18.96 55.77,18.9 55.95,18.81 56.1,18.68 56.23,18.52 56.32,18.34 56.38,18.15 56.4,17.97 56.4,11.84 56.38,11.67 56.32,11.47 56.23,11.29 56.1,11.14 55.95,11.01 55.77,10.91 55.57,10.86 55.4,10.84 34.78,10.84 34.61,10.86 34.41,10.91 34.23,11.01 34.07,11.14 33.95,11.29 33.85,11.47 33.8,11.67 33.78,11.84
GND on Top Layer: 24.13,6.14 54.1,6.14 54.1,0.3 24.13,0.3
GND on Top Layer: 33.78,32.56 60.96,32.56 60.96,16.81 33.78,16.81
GND on Top Layer: 39.24,30.91 39.78,31.13 40.01,31.67 40.01,40.05 39.67,40.86 38.86,41.2 25.53,41.2 24.99,40.97 24.77,40.43 24.77,31.67 24.99,31.13 25.53,30.91
GND on Bottom Layer: 0.76,43.74 65.28,43.74 67.79,42.69 68.83,40.18 68.83,20.11 68.46,19.22 67.56,18.84 56.64,18.84 56.1,18.62 55.73,17.72 55.37,17.57 41.39,17.57 33.32,20.92 29.1,31.1 26.99,31.98 11.76,31.98 11.35,32.15 11.18,32.56 11,32.49 10.92,32.31 10.92,25.45 10.62,24.73 9.91,24.43 7.6,27.55 7.6,42.72 0.76,42.72
BLUE.OUT on Top Layer: 34.52,10.49 38.86,10.49 38.86,7.92 34.52,7.92
BLUE.OUT on Bottom Layer: 35.28,10.49 38.86,10.49 38.86,7.92 35.28,7.92
BLUE.OUT on Bottom Layer: 35.29,15.54 62.1,15.54 62.1,1.57 35.29,1.57
CW.OUT on Top Layer: 54.86,13 62.15,13 62.15,8.81 54.86,8.81
GREEN.OUT on Top Layer: 44.52,10.49 48.35,10.49 48.35,7.92 44.52,7.92
GREEN.OUT on Bottom Layer: 44.96,10.49 57.02,10.49 57.02,0.56 44.96,0.56
RED.OUT on Top Layer: 39.52,10.49 43.86,10.49 43.86,7.92 39.52,7.92
RED.OUT on Bottom Layer: 40.03,13.26 59.56,13.26 59.56,1.22 40.03,1.22
WW.OUT on Top Layer: 50.04,10.46 62.15,10.46 62.15,5.64 50.04,5.64
$1N1755 on Top Layer: 29.21,29.26 45.21,29.26 45.21,21.13 29.21,21.13

## Text on the board
Bottom Solder Mask Layer: RGB
Bottom Silkscreen Layer: Dieu de l'élec | C. GAILLARD | G | R | CW | WW | B | RGB | CONNECT
Document Layer: Opensource is love | 19.12.2025 | C. GAILLARD / #Dieu de l'élec / RGB Connect
Top Silkscreen Layer: + | SCL | SDA | D20 | D21 | 3.3V | +5V | A2 | D6 | D7 | D10
